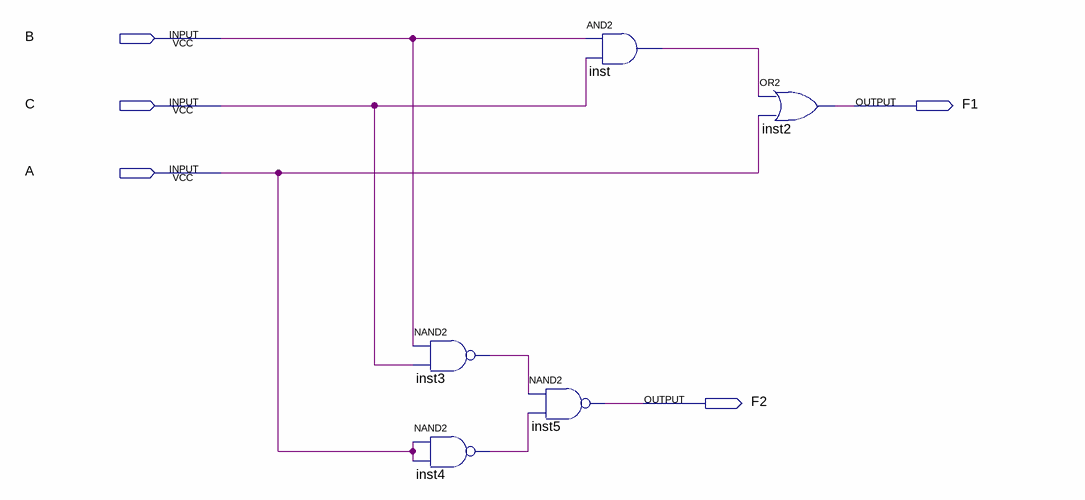
[diagram p0: schematic sheet]
// Quartus schematic 1.3.bdf as structural Verilog: 5 symbols, 5 pins
module \1.3  (
  input  B,
  input  C,
  input  A,
  output F1,
  output F2
);

  wire inst3_out, inst4_out, inst_out;

  nand inst3 (inst3_out, B, C);
  nand inst4 (inst4_out, A, A);
  nand inst5 (F2, inst3_out, inst4_out);
  and inst (inst_out, B, C);
  or inst2 (F1, inst_out, A);
endmodule
